# EAGLE design drive_board (EAGLE 6.1)
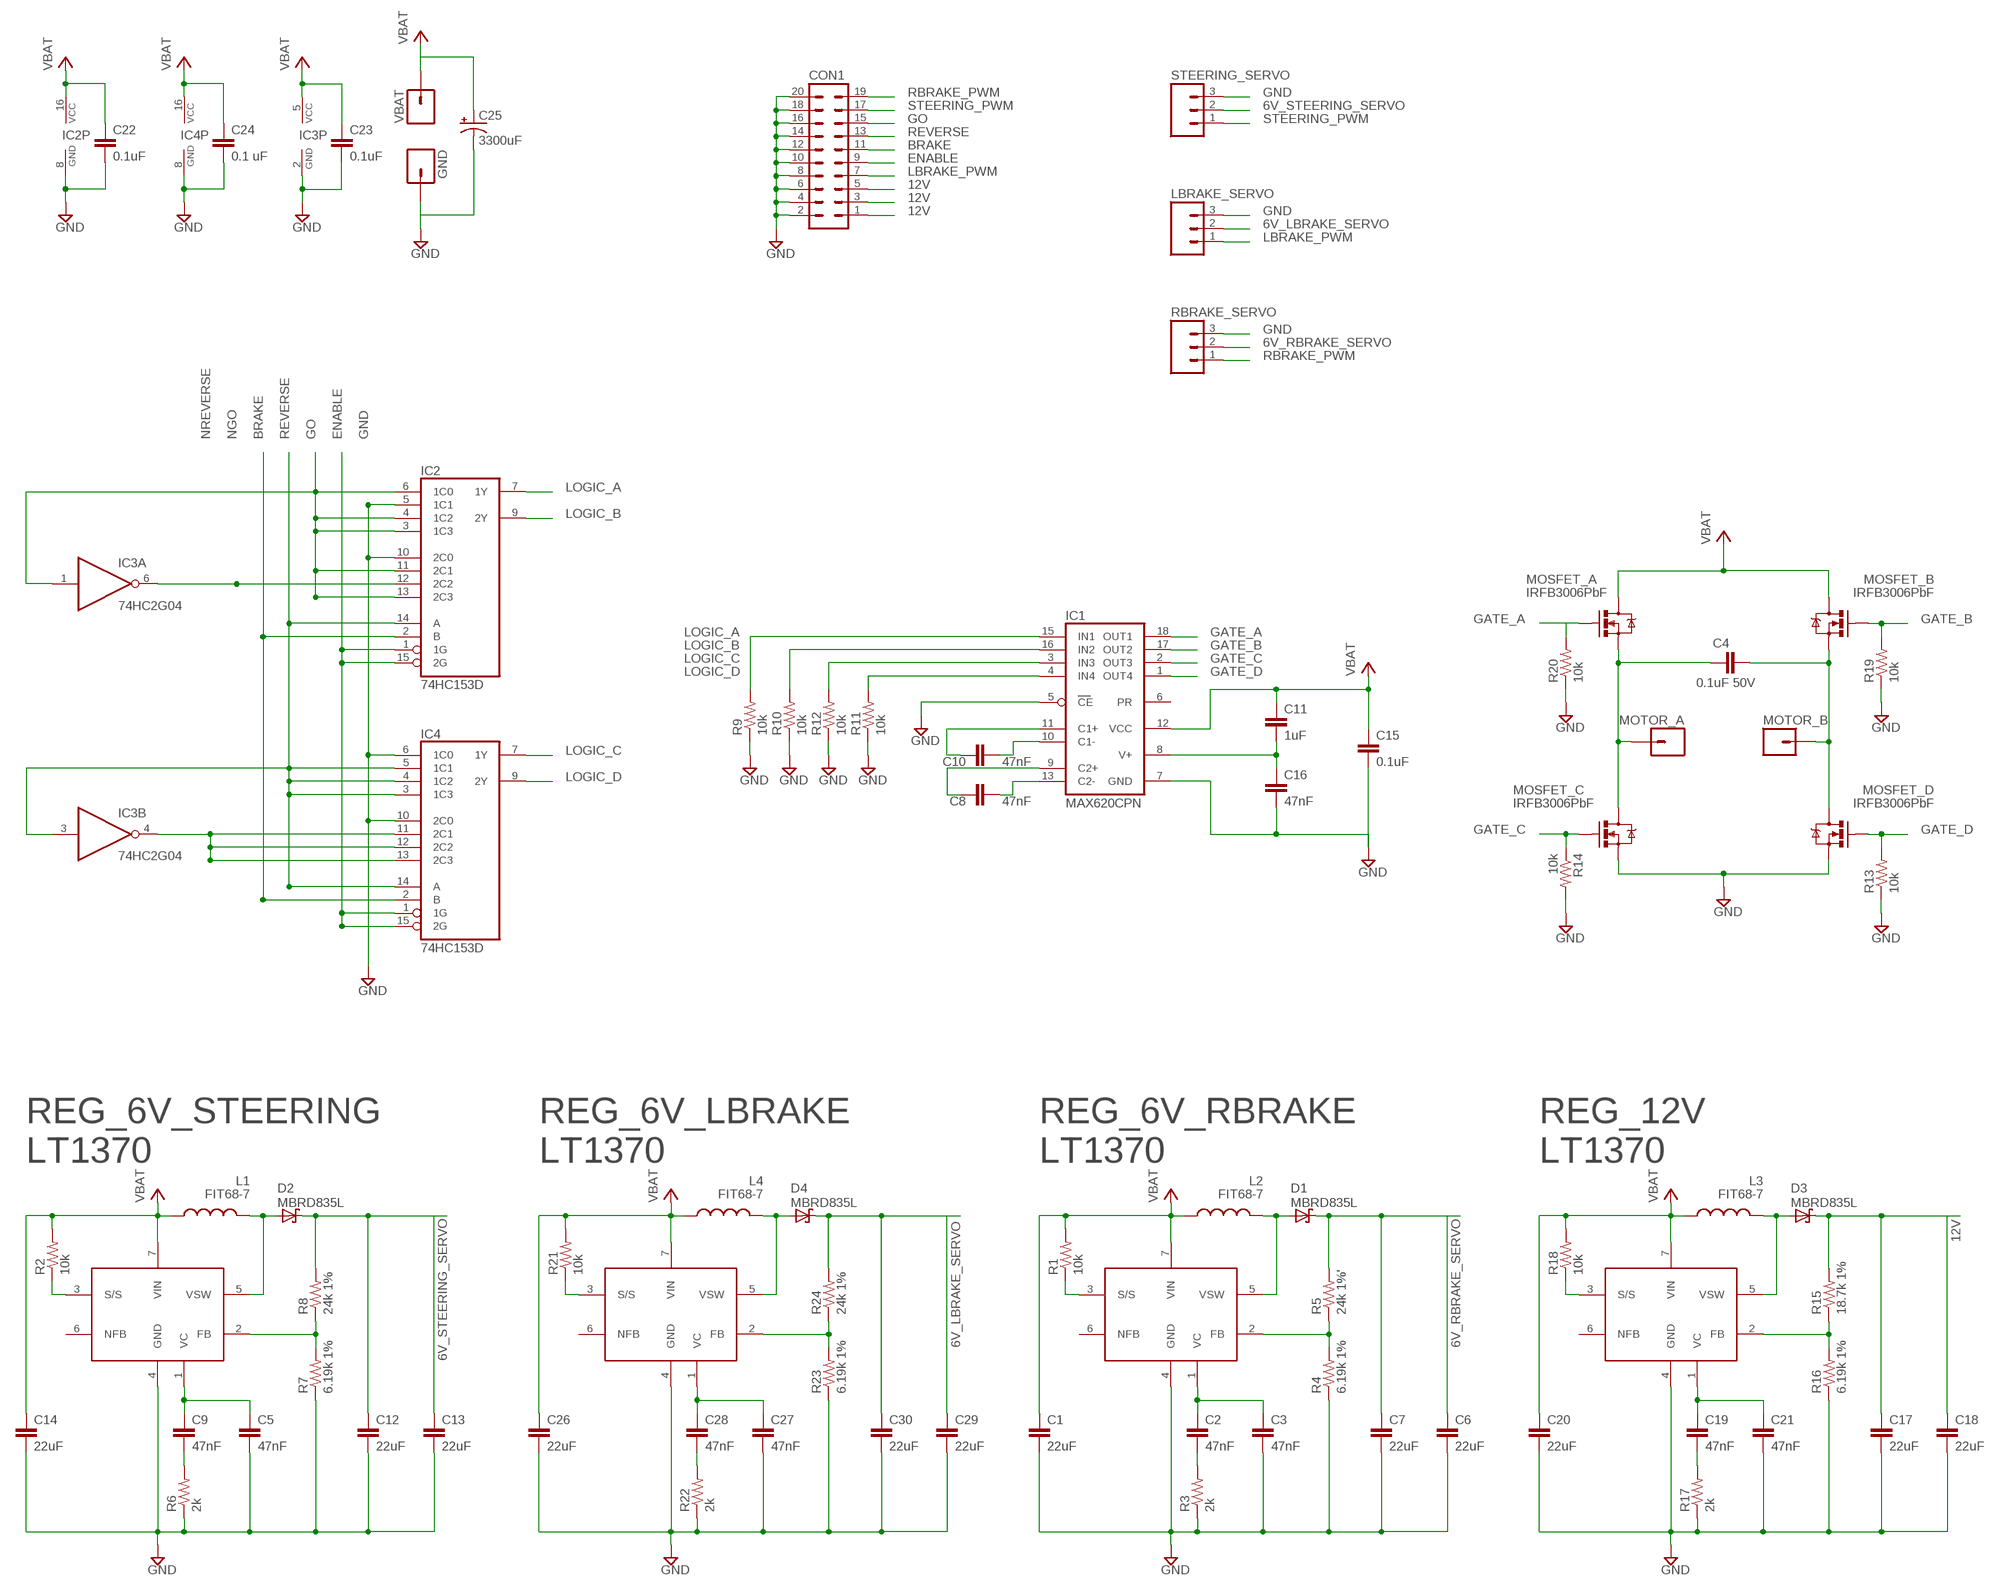
[diagram p0: schematic, sheet 1]

## Parts
C1  22uF  TPSD226M025R0200  [CAPACITOR_CASE_D]
C2  47nF  CAP0603-CAP  [0603-CAP]
C3  47nF  CAP0603-CAP  [0603-CAP]
C4  0.1uF 50V  CAP0603-CAP  [0603-CAP]
C5  47nF  CAP0603-CAP  [0603-CAP]
C6  22uF  TPSD226M025R0200  [CAPACITOR_CASE_D]
C7  22uF  TPSD226M025R0200  [CAPACITOR_CASE_D]
C8  47nF  CAP0603-CAP  [0603-CAP]
C9  47nF  CAP0603-CAP  [0603-CAP]
C10  47nF  CAP0603-CAP  [0603-CAP]
C11  1uF  CAP0603-CAP  [0603-CAP]
C12  22uF  TPSD226M025R0200  [CAPACITOR_CASE_D]
C13  22uF  TPSD226M025R0200  [CAPACITOR_CASE_D]
C14  22uF  TPSD226M025R0200  [CAPACITOR_CASE_D]
C15  0.1uF  CAP0603-CAP  [0603-CAP]
C16  47nF  CAP0603-CAP  [0603-CAP]
C17  22uF  TPSD226M025R0200  [CAPACITOR_CASE_D]
C18  22uF  TPSD226M025R0200  [CAPACITOR_CASE_D]
C19  47nF  CAP0603-CAP  [0603-CAP]
C20  22uF  TPSD226M025R0200  [CAPACITOR_CASE_D]
C21  47nF  CAP0603-CAP  [0603-CAP]
C22  0.1uF  CAP0603-CAP  [0603-CAP]
C23  0.1uF  CAP0603-CAP  [0603-CAP]
C24  0.1 uF  CAP0603-CAP  [0603-CAP]
C25  3300uF  CAP_POLPTH1  [CPOL-RADIAL-100UF-25V]
C26  22uF  TPSD226M025R0200  [CAPACITOR_CASE_D]
C27  47nF  CAP0603-CAP  [0603-CAP]
C28  47nF  CAP0603-CAP  [0603-CAP]
C29  22uF  TPSD226M025R0200  [CAPACITOR_CASE_D]
C30  22uF  TPSD226M025R0200  [CAPACITOR_CASE_D]
CON1  ML20  [ML20]
D1  MBRD835L  [DPACK_1]
D2  MBRD835L  [DPACK_1]
D3  MBRD835L  [DPACK_1]
D4  MBRD835L  [DPACK_1]
GND  GND  PAD_12GAPTH  [PAD_12GA]
IC1  MAX620CPN  [DIL18]
IC2  74HC153D  [SO16]
IC3  74HC2G04  [TSSOP6]
IC4  74HC153D  [SO16]
L1  FIT68-7  INDUCTOR  [TOROID_INDUCTOR]
L2  FIT68-7  INDUCTOR  [TOROID_INDUCTOR]
L3  FIT68-7  INDUCTOR  [TOROID_INDUCTOR]
L4  FIT68-7  INDUCTOR  [TOROID_INDUCTOR]
LBRAKE_SERVO  M03POLAR  [MOLEX-1X3]
MOSFET_A  IRFB3006PbF  MOSFET-NCHANNELPTH2  [TO220V]
MOSFET_B  IRFB3006PbF  MOSFET-NCHANNELPTH2  [TO220V]
MOSFET_C  IRFB3006PbF  MOSFET-NCHANNELPTH2  [TO220V]
MOSFET_D  IRFB3006PbF  MOSFET-NCHANNELPTH2  [TO220V]
MOTOR_A  MOTOR A  PAD_12GAPTH  [PAD_12GA]
MOTOR_B  MOTOR B  PAD_12GAPTH  [PAD_12GA]
R1  10k  RESISTOR0603-RES  [0603-RES]
R2  10k  RESISTOR0603-RES  [0603-RES]
R3  2k  RESISTOR0603-RES  [0603-RES]
R4  6.19k 1%  RESISTOR0603-RES  [0603-RES]
R5  24k 1%'  RESISTOR0603-RES  [0603-RES]
R6  2k  RESISTOR0603-RES  [0603-RES]
R7  6.19k 1%  RESISTOR0603-RES  [0603-RES]
R8  24k 1%  RESISTOR0603-RES  [0603-RES]
R9  10k  RESISTOR0603-RES  [0603-RES]
R10  10k  RESISTOR0603-RES  [0603-RES]
R11  10k  RESISTOR0603-RES  [0603-RES]
R12  10k  RESISTOR0603-RES  [0603-RES]
R13  10k  RESISTOR0603-RES  [0603-RES]
R14  10k  RESISTOR0603-RES  [0603-RES]
R15  18.7k 1%  RESISTOR0603-RES  [0603-RES]
R16  6.19k 1%  RESISTOR0603-RES  [0603-RES]
R17  2k  RESISTOR0603-RES  [0603-RES]
R18  10k  RESISTOR0603-RES  [0603-RES]
R19  10k  RESISTOR0603-RES  [0603-RES]
R20  10k  RESISTOR0603-RES  [0603-RES]
R21  10k  RESISTOR0603-RES  [0603-RES]
R22  2k  RESISTOR0603-RES  [0603-RES]
R23  6.19k 1%  RESISTOR0603-RES  [0603-RES]
R24  24k 1%  RESISTOR0603-RES  [0603-RES]
RBRAKE_SERVO  M03POLAR  [MOLEX-1X3]
REG_6V_LBRAKE  LT1370  [TO220-7]
REG_6V_RBRAKE  LT1370  [TO220-7]
REG_6V_STEERING  LT1370  [TO220-7]
REG_12V  LT1370  [TO220-7]
STEERING_SERVO  M03POLAR  [MOLEX-1X3]
VBAT  7.2V  PAD_12GAPTH  [PAD_12GA]

## Nets
6V_LBRAKE_SERVO: C29.P$1 C30.P$1 D4.C LBRAKE_SERVO.2 R24.2
6V_RBRAKE_SERVO: C6.P$1 C7.P$1 D1.C R5.2 RBRAKE_SERVO.2
6V_STEERING_SERVO: C12.P$1 C13.P$1 D2.C R8.2 STEERING_SERVO.2
12V: C17.P$1 C18.P$1 CON1.1 CON1.3 CON1.5 D3.C R15.2
BRAKE: CON1.11 IC2.2(B) IC4.2(B)
ENABLE: CON1.9 IC2.1(1G) IC2.15(2G) IC4.1(1G) IC4.15(2G)
GATE_A: IC1.18(OUT1) MOSFET_A.1(G) R20.2
GATE_B: IC1.17(OUT2) MOSFET_B.1(G) R19.2
GATE_C: IC1.2(OUT3) MOSFET_C.1(G) R14.1
GATE_D: IC1.1(OUT4) MOSFET_D.1(G) R13.2
GND: C1.P$2 C3.2 C5.2 C6.P$2 C7.P$2 C12.P$2 C13.P$2 C14.P$2 C15.2 C16.2 C17.P$2 C18.P$2 C20.P$2 C21.2 C22.2 C23.2 C24.2 C25.2(-) C26.P$2 C27.2 C29.P$2 C30.P$2 CON1.2 CON1.4 CON1.6 CON1.8 CON1.10 CON1.12 CON1.14 CON1.16 CON1.18 CON1.20 GND.1 IC1.5(CE) IC1.7(GND) IC2.5(1C1) IC2.8(GND) IC2.10(2C0) IC3.2(P:GND) IC4.6(1C0) IC4.8(GND) IC4.10(2C0) LBRAKE_SERVO.3 MOSFET_C.3(S) MOSFET_D.3(S) R3.1 R4.1 R6.1 R7.1 R9.1 R10.1 R11.1 R12.1 R13.1 R14.2 R16.1 R17.1 R19.1 R20.1 R22.1 R23.1 RBRAKE_SERVO.3 REG_6V_LBRAKE.4(GND) REG_6V_RBRAKE.4(GND) REG_6V_STEERING.4(GND) REG_12V.4(GND) STEERING_SERVO.3
GO: CON1.15 IC2.3(1C3) IC2.4(1C2) IC2.6(1C0) IC2.11(2C1) IC2.13(2C3) IC3.1(A:I)
LBRAKE_PWM: CON1.7 LBRAKE_SERVO.1
LOGIC_A: IC1.15(IN1) IC2.7(1Y) R9.2
LOGIC_B: IC1.16(IN2) IC2.9(2Y) R10.2
LOGIC_C: IC1.3(IN3) IC4.7(1Y) R12.2
LOGIC_D: IC1.4(IN4) IC4.9(2Y) R11.2
MOTOR_A: C4.1 MOSFET_A.3(S) MOSFET_C.2(D) MOTOR_A.1
MOTOR_B: C4.2 MOSFET_B.3(S) MOSFET_D.2(D) MOTOR_B.1
N$1: C10.1 IC1.11(C1+)
N$2: C10.2 IC1.10(C1-)
N$3: C8.2 IC1.13(C2-)
N$4: C8.1 IC1.9(C2+)
N$5: D2.B(A) D2.E(A) L1.2 REG_6V_STEERING.5(VSW)
N$6: R7.2 R8.1 REG_6V_STEERING.2(FB)
N$7: D4.B(A) D4.E(A) L4.2 REG_6V_LBRAKE.5(VSW)
N$8: R23.2 R24.1 REG_6V_LBRAKE.2(FB)
N$9: C5.1 C9.1 REG_6V_STEERING.1(VC)
N$10: C27.1 C28.1 REG_6V_LBRAKE.1(VC)
N$11: C9.2 R6.2
N$12: R2.1 REG_6V_STEERING.3(S/S)
N$13: C28.2 R22.2
N$14: R21.1 REG_6V_LBRAKE.3(S/S)
N$15: D1.B(A) D1.E(A) L2.2 REG_6V_RBRAKE.5(VSW)
N$16: R4.2 R5.1 REG_6V_RBRAKE.2(FB)
N$17: C2.1 C3.1 REG_6V_RBRAKE.1(VC)
N$18: C2.2 R3.2
N$19: R1.1 REG_6V_RBRAKE.3(S/S)
N$20: D3.B(A) D3.E(A) L3.2 REG_12V.5(VSW)
N$21: R15.1 R16.2 REG_12V.2(FB)
N$22: C19.1 C21.1 REG_12V.1(VC)
N$23: C19.2 R17.2
N$24: R18.1 REG_12V.3(S/S)
NGO: IC2.12(2C2) IC3.6(A:O)
NREVERSE: IC3.4(B:O) IC4.11(2C1) IC4.12(2C2) IC4.13(2C3)
RBRAKE_PWM: CON1.19 RBRAKE_SERVO.1
REVERSE: CON1.13 IC2.14(A) IC3.3(B:I) IC4.3(1C3) IC4.4(1C2) IC4.5(1C1) IC4.14(A)
STEERING_PWM: CON1.17 STEERING_SERVO.1
V+: C11.2 C16.1 IC1.8(V+)
VBAT: C1.P$1 C11.1 C14.P$1 C15.1 C20.P$1 C22.1 C23.1 C24.1 C25.1(+) C26.P$1 IC1.12(VCC) IC2.16(VCC) IC3.5(P:VCC) IC4.16(VCC) L1.1 L2.1 L3.1 L4.1 MOSFET_A.2(D) MOSFET_B.2(D) R1.2 R2.2 R18.2 R21.2 REG_6V_LBRAKE.7(VIN) REG_6V_RBRAKE.7(VIN) REG_6V_STEERING.7(VIN) REG_12V.7(VIN) VBAT.1
Unconnected: IC1.6(PR) REG_6V_LBRAKE.6(NFB) REG_6V_RBRAKE.6(NFB) REG_6V_STEERING.6(NFB) REG_12V.6(NFB)

## Library data of the parts
C1 C6 C7 C12-C14 C17 C18 C20 C26 C29 C30 = group10:TPSD226M025R0200
C2-C5 C8-C11 C15 C16 C19 C21 C27 C28 = SparkFun:CAP: Capacitor Standard 0603 ceramic capacitor, and 0.1" leaded capacitor.
C22-C24 = SparkFun-Passives:CAP: Capacitor Standard 0603 ceramic capacitor, and 0.1" leaded capacitor.
C25 = SparkFun-Passives:CAP_POL: Capacitor Polarized These are standard SMD and PTH capacitors. Normally 10uF, 47uF, and 100uF in electrolytic and tantalum varieties. Always verify the external diameter of the through hole cap, it varies with capacity, voltage, and manufacturer. The EIA devices should be standard.
CON1 = con-harting-ml:ML20: HARTING; OC_FARNELL: unknown; OC_NEWARK: unknown
D1-D4 = group10:MBRD835L
GND MOTOR_A MOTOR_B VBAT = group10:PAD_12GA: Header 1 Standard 1-pin 0.1" header. Use with straight break away headers (SKU : PRT-00116), right angle break away headers (PRT-00553), swiss pins (PRT-00743), machine pins (PRT-00117), and female headers (PRT-00115).
IC1 = maxim:MAX620CPN: MOSFET DRIVER; MPN: MAX620CPN+; OC_FARNELL: unknown; OC_NEWARK: 27M4142
IC2 IC4 = 74xx-eu:74*153: Dual 4-line to 1-line data SELECTOR/MULTIPLEXER
IC3 = group10:74HC2G04
L1-L4 = group10:INDUCTOR: Inductors Basic Inductor/Choke - 0603 and 1206. Footprints are not proven and vary greatly between part numbers.
LBRAKE_SERVO RBRAKE_SERVO STEERING_SERVO = SparkFun-Connectors:M03: Header 3 Standard 3-pin 0.1" header. Use with straight break away headers (SKU : PRT-00116), right angle break away headers (PRT-00553), swiss pins (PRT-00743), machine pins (PRT-00117), and female headers (PRT-00115). Molex polarized connector foot print use with SKU : PRT-08232 with associated crimp pins and housings.
MOSFET_A MOSFET_B MOSFET_C MOSFET_D = group10:MOSFET-NCHANNEL: Generic NMOS footprint
R1-R24 = SparkFun:RESISTOR: Resistor Basic schematic elements and footprints for 0603, 1206, and PTH resistors.
REG_6V_LBRAKE REG_6V_RBRAKE REG_6V_STEERING REG_12V = group10:LT1370

## Board
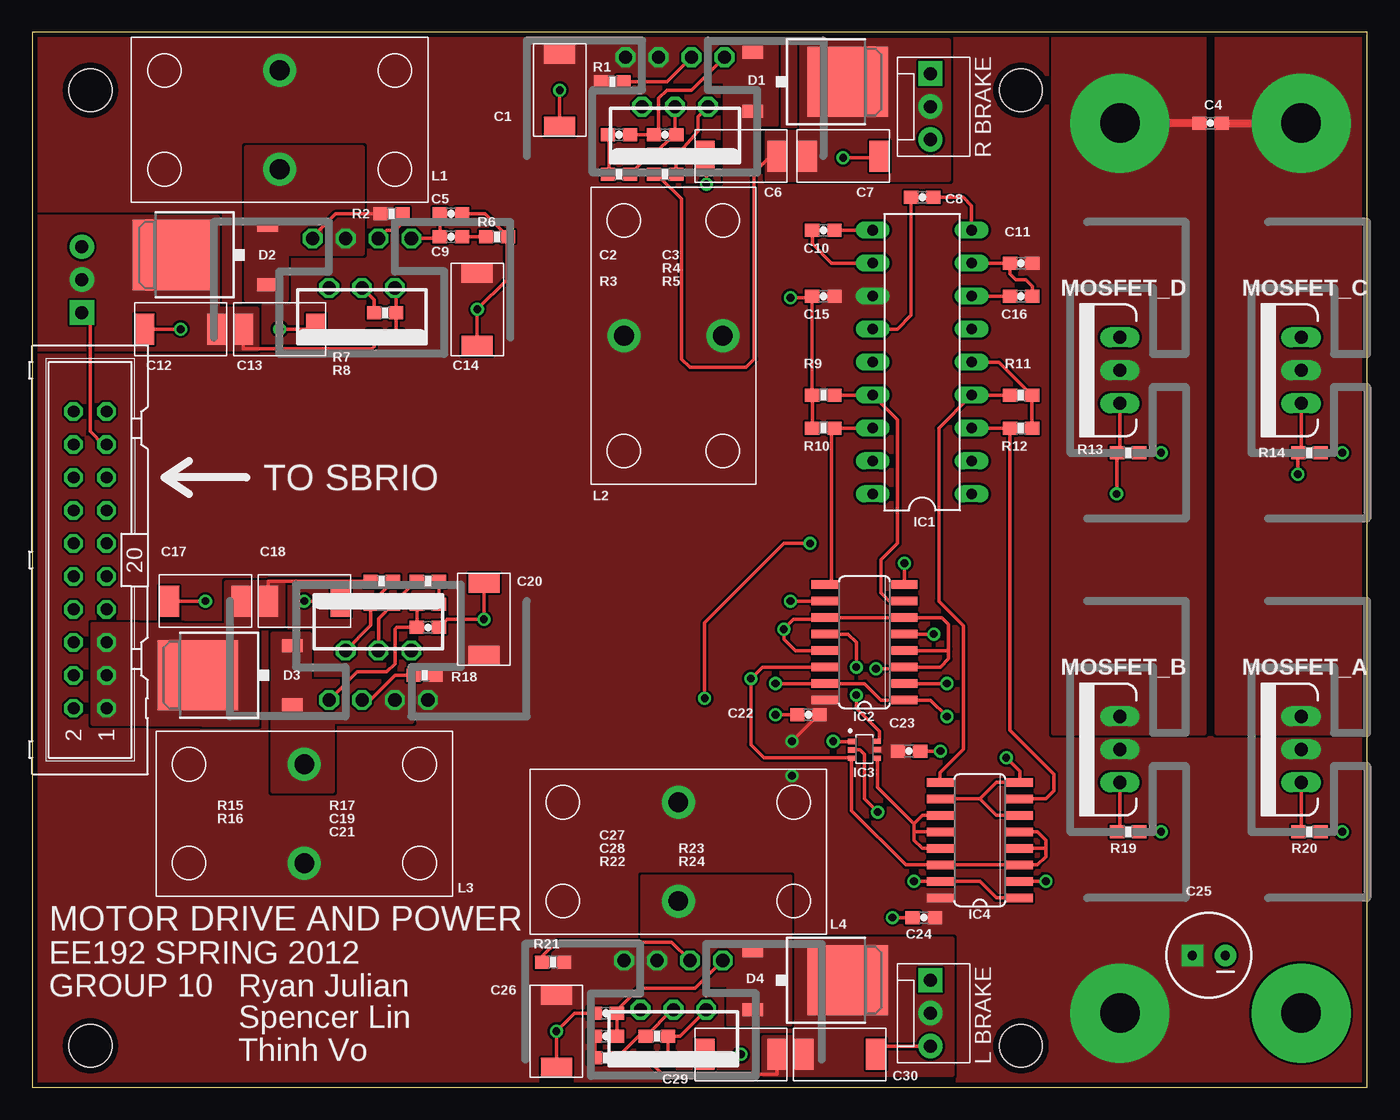
[diagram p1: board, top side]
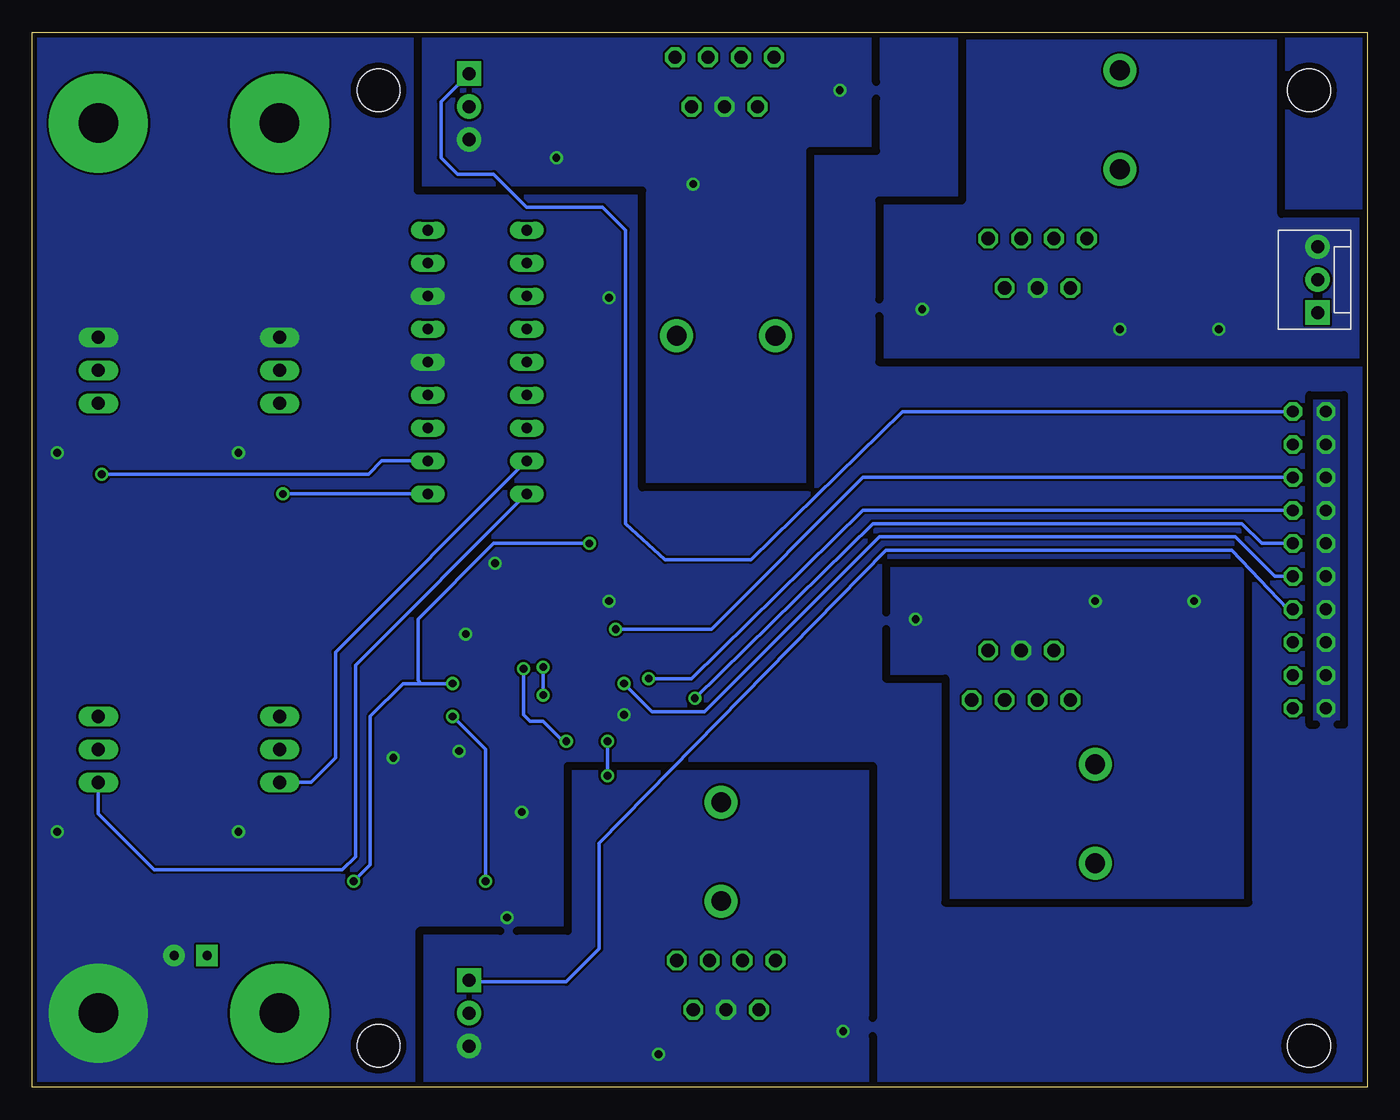
[diagram p2: board, bottom side, seen from below]

Size 102.87 x 81.28 mm. Coordinates in mm from the lower left corner, seen from the top.
Outline: 0,0 102.87,0 102.87,81.28 0,81.28 0,0
Copper layers (1*16): Top 0.035559375mm / dielectric 1.501140625mm / Bottom 0.035559375mm
Design rules: minimum track width 10mil, minimum drill 15mil, track to track 6mil, track to pad 6mil, pad to pad 6mil, via to via 6mil, smd to smd 6mil, copper to edge 15mil, drill to drill 8mil, minimum pad ring 10mil, minimum via ring 8mil, stop-mask expansion 4mil, vias tented up to drill 0mil, thermal gap 10mil
bRestrict: 36 lines

### Footprints (pad centres in the part's own frame; a part is rotated, then mirrored left to right if it is on the bottom)
CAPACITOR_CASE_D = smd 1.524 x 2.388: P$1 -2.794,0; P$2 2.794,0
0603-CAP = smd 1.1 x 1: 1 -0.85,0; 2 0.85,0
CPOL-RADIAL-100UF-25V = drill 0.7 pad 1.651 square: 1 1.27,0 | drill 0.7 pad 1.651: 2 -1.27,0
ML20 = drill 0.914 octagon: 1 -11.43,-1.27; 2 -11.43,1.27; 3 -8.89,-1.27; 4 -8.89,1.27; 5 -6.35,-1.27; 6 -6.35,1.27; 7 -3.81,-1.27; 8 -3.81,1.27; 9 -1.27,-1.27; 10 -1.27,1.27; 11 1.27,-1.27; 12 1.27,1.27; 13 3.81,-1.27; 14 3.81,1.27; 15 6.35,-1.27; 16 6.35,1.27; 17 8.89,-1.27; 18 8.89,1.27; 19 11.43,-1.27; 20 11.43,1.27
DPACK_1 = smd 1 x 1.6: B -2.28,-6.07; E 2.28,-6.07 | smd 5.4 x 6.2: C 0,1.23
PAD_12GA = drill 3.048 pad 7.62: 1 0,0
DIL18 = drill 0.813 long: 1 -10.16,-3.81; 2 -7.62,-3.81; 3 -5.08,-3.81; 4 -2.54,-3.81; 5 0,-3.81; 6 2.54,-3.81; 7 5.08,-3.81; 8 7.62,-3.81; 9 10.16,-3.81; 10 10.16,3.81; 11 7.62,3.81; 12 5.08,3.81; 13 2.54,3.81; 14 0,3.81; 15 -2.54,3.81; 16 -5.08,3.81; 17 -7.62,3.81; 18 -10.16,3.81
SO16 = smd 0.66 x 2.032: 1 -4.445,-3.073; 2 -3.175,-3.073; 3 -1.905,-3.073; 4 -0.635,-3.073; 5 0.635,-3.073; 6 1.905,-3.073; 7 3.175,-3.073; 8 4.445,-3.073; 9 4.445,3.073; 10 3.175,3.073; 11 1.905,3.073; 12 0.635,3.073; 13 -0.635,3.073; 14 -1.905,3.073; 15 -3.175,3.073; 16 -4.445,3.073
TSSOP6 = smd 0.55 x 0.4: 1 -0.99,0.61; 2 -0.99,-0.04; 3 -0.99,-0.69; 4 0.99,-0.69; 5 0.99,-0.015; 6 0.99,0.62
TOROID_INDUCTOR = drill 1.524 pad 2.54: 1 0,3.81; 2 0,-3.81
MOLEX-1X3 = drill 1.016 pad 1.88 square: 1 0,0 | drill 1.016 pad 1.88: 2 2.54,0; 3 5.08,0
TO220V = drill 1.016 long: 1 -2.54,0; 2 0,0; 3 2.54,0
0603-RES = smd 1.1 x 1: 1 -0.85,0; 2 0.85,0
TO220-7 = drill 1.016 octagon: 1 -3.81,3.81; 2 0,2.54; 3 -3.81,1.27; 4 0,0; 5 -3.81,-1.27; 6 0,-2.54; 7 -3.81,-3.81
STAND-OFF = hole 3.302: 0,0

### Placement (x,y rotation side)
C1  40.64,76.83 270 top
C2  45.21,73.41 180 top
C3  48.77,73.41 0 top
C4  90.81,74.3 180 top
C5  32.26,67.31 0 top
C6  54.61,71.75 180 top
C7  62.48,71.75 0 top
C8  68.58,68.58 180 top
C9  32.26,65.53 0 top
C10  60.96,66.04 0 top
C11  76.2,63.5 180 top
C12  11.43,58.42 180 top
C13  19.05,58.42 0 top
C14  34.29,59.94 270 top
C15  60.96,60.96 180 top
C16  76.2,60.96 180 top
C17  13.34,37.47 180 top
C18  20.95,37.47 0 top
C19  30.48,37.21 0 top
C20  34.8,36.07 90 top
C21  30.48,35.43 0 top
C22  59.82,28.7 180 top
C23  67.56,25.91 0 top
C24  68.71,13.08 180 top
C25  90.68,10.16 180 top
C26  40.39,4.32 270 top
C27  44.2,5.71 180 top
C28  44.2,3.94 180 top
C29  54.61,2.54 180 top
C30  62.23,2.54 0 top
CON1  4.45,40.64 90 top
D1  61.59,77.47 270 top
D2  12.06,64.14 90 top
D3  13.97,31.75 90 top
D4  61.59,8.26 270 top
GND  97.79,5.71 0 top
IC1  68.58,55.88 90 top
IC2  64.14,34.29 90 top
IC3  64.14,26.04 0 top
IC4  73.03,19.05 90 top
L1  19.05,74.55 0 top
L2  49.4,57.91 90 top
L3  20.95,21.08 180 top
L4  49.78,18.16 0 top
LBRAKE_SERVO  69.22,8.26 270 top
MOSFET_A  97.79,26.04 90 top
MOSFET_B  83.82,26.04 90 top
MOSFET_C  97.79,55.24 90 top
MOSFET_D  83.82,55.24 90 top
MOTOR_A  97.79,74.3 0 top
MOTOR_B  83.82,74.3 0 top
R1  44.7,77.47 180 top
R2  27.69,67.31 180 top
R3  45.21,70.36 180 top
R4  48.77,71.88 0 top
R5  48.77,70.36 180 top
R6  35.81,65.53 180 top
R7  27.18,59.69 0 top
R8  27.18,57.91 180 top
R9  60.96,53.34 0 top
R10  60.96,50.8 0 top
R11  76.2,53.34 180 top
R12  76.2,50.8 180 top
R13  84.45,48.9 180 top
R14  98.42,48.9 0 top
R15  26.92,38.99 180 top
R16  26.92,37.21 180 top
R17  30.48,38.99 0 top
R18  30.23,31.75 0 top
R19  84.45,19.68 180 top
R20  98.42,19.68 180 top
R21  40.13,9.65 0 top
R22  44.2,2.29 180 top
R23  48.13,3.94 0 top
R24  48.13,2.29 180 top
RBRAKE_SERVO  69.22,78.11 270 top
REG_6V_LBRAKE  49.4,5.97 270 top
REG_6V_RBRAKE  49.53,75.56 270 top
REG_6V_STEERING  25.4,61.59 270 top
REG_12V  26.67,33.66 90 top
STEERING_SERVO  3.81,59.69 90 bottom
U$1  [STAND-OFF]  4.47,76.83 0 top
U$2  [STAND-OFF]  76.2,76.83 0 top
U$3  [STAND-OFF]  4.47,3.2 0 top
U$4  [STAND-OFF]  76.2,3.2 0 top
VBAT  83.82,5.71 0 top

### Tracks (layer width: path | path; a pad name or v marks a point on that pad's centre or on a via)
6V_LBRAKE_SERVO
  Top 0.254: R24.2 48.55,1.02 57.4,1.02 C29.P$1
  pour Top (isolate 0.178, no thermals): 56.39,3.81 58.93,3.81 58.93,11.43 70.87,11.43 70.87,1.02 56.39,1.02
6V_RBRAKE_SERVO
  Top 0.254: C6.P$1 56.9,71.75 55.63,70.48 55.63,56.11 54.99,55.47 50.67,55.47 50.04,56.11 50.04,68.45 48.43,70.06 R5.2
  pour Top (isolate 0.178, no thermals): 59.31,80.64 59.31,73.53 56.64,73.53 56.64,69.98 70.61,69.98 70.61,80.64
6V_STEERING_SERVO
  Top 0.254: R8.2 26.33,57.06 26.16,56.9 16.26,56.9 C13.P$1
  pour Top (isolate 0.178, no thermals): 17.27,58.67 17.27,59.94 14.22,59.94 14.22,67.06 0,67.06 0,56.9 17.27,56.9
12V
  Top 0.254: 26.16,38.99 R15.2 18.16,38.99 C18.P$1
  pour Top (isolate 0.178, no thermals): 17.27,27.94 4.7,28.07 4.7,35.69 14.99,35.56 14.99,38.86 19.3,38.86 19.3,35.56 17.27,35.56
BRAKE  (via drill 0.6)
  Top 0.254: IC2.2 v70.48,31.11 | IC4.2 v78.11,15.88 | v51.82,29.97 51.82,35.81 57.91,41.91 v59.94,41.91
  Bottom 0.254: v70.48,31.11 72.9,31.11 | 72.9,31.11 74.3,31.11 76.83,28.57 76.83,17.14 v78.11,15.88 | CON1.11 8.13,41.91 9.65,43.43 38.1,43.43 v51.82,29.97 | v59.94,41.91 67.31,41.91 73.15,36.07 73.15,31.37 72.9,31.11
ENABLE  (via drill 0.6)
  Top 0.254: IC4.1 74.3,14.61 73.03,15.88 IC4.15 v67.94,15.88 | v70.48,28.57 69.22,29.84 IC2.1 65.41,29.84 64.14,31.11 IC2.15 v57.28,31.11
  Bottom 0.254: v70.48,28.57 67.94,26.04 v67.94,15.88 | CON1.9 7.11,39.37 10.16,42.42 37.59,42.42 51.05,28.96 55.12,28.96 v57.28,31.11
GATE_A
  Top 0.254: MOSFET_A.1 97.79,19.68 R20.2
  Bottom 0.254: IC1.18 77.98,32.51 77.98,17.78 78.99,16.76 93.47,16.76 97.79,21.08 MOSFET_A.1
GATE_B
  Top 0.254: MOSFET_B.1 83.82,19.68 R19.2
  Bottom 0.254: IC1.17 79.5,33.53 79.5,25.4 81.41,23.5 MOSFET_B.1
GATE_C  (via drill 0.6)
  Top 0.254: MOSFET_C.1 97.79,48.9 R14.1 97.54,48.86 v97.54,47.24
  Bottom 0.254: IC1.2 75.95,48.26 76.96,47.24 v97.54,47.24
GATE_D  (via drill 0.6)
  Top 0.254: MOSFET_D.1 83.82,48.9 R13.2 83.57,48.9 | 83.19,48.9 83.57,48.9 | 83.57,48.9 v83.57,45.72
  Bottom 0.254: IC1.1 v83.57,45.72
GND  (via drill 0.6)
  Top 0.254: R13.1 v87,48.9 | R14.2 v100.97,48.9 | R19.1 v87,19.68 | R20.1 v100.97,19.68 | IC2.10 v58.42,37.47 | IC2.8 v67.21,40.39 | IC2.5 v69.47,34.92 | C24.2 v66.29,13.08 | C23.2 v69.98,25.91 | v75.06,25.4 76.1,24.36 IC4.8 74.3,23.5 73.03,22.23 | 73.03,22.23 IC4.10 | IC4.6 74.3,20.95 73.03,22.23 | C22.2 v57.28,28.7 | IC3.2 63.79,26 64.14,25.65 64.14,22.23 v65.15,21.21 | R10.1 60.11,53.3 60.07,53.34 | 60.07,53.34 60.07,60.83 | 60.07,60.83 v58.42,60.83 | 60.07,60.83 60.07,60.92 C15.2 | IC1.5 74.51,55.88 R11.1 R12.1 | IC1.7 C16.2 | C26.P$2 v40.39,4.32 41.78,5.71 C27.2 | C17.P$2 v13.34,37.47 | C14.P$2 v34.29,59.94 36.58,62.23 36.58,65.53 R6.1 34.89,67.31 C5.2 | C1.P$2 v40.64,76.83 | C30.P$2 65.66,3.17 LBRAKE_SERVO.3 | R22.1 46.7,3.94 R23.1 49.31,5.97 REG_6V_LBRAKE.4 | C29.P$2 v54.61,2.54 | C20.P$2 v34.8,36.07 31.96,36.07 C21.2 | C18.P$2 v20.95,37.47 | REG_12V.4 26.67,36.11 R16.1 29.55,38.99 R17.1 | REG_6V_STEERING.4 26.33,60.67 R7.1 | C13.P$2 v19.05,58.42 | C7.P$2 65.15,71.63 v62.48,71.63 | R3.1 47.59,71.88 R4.1 49.44,73.41 C3.2 | 49.66,73.41 C3.2 | C3.2 49.53,73.49 REG_6V_RBRAKE.4 | C6.P$2 51.94,71.63 v51.94,69.6 | C12.P$2 v11.43,58.42 | R9.1 60.07,53.34
  pour Bottom (isolate 0.178, rank 6, no thermals): 0,81.28 102.87,81.28 102.87,0 0,0
GO  (via drill 0.6)
  Top 0.254: v65.02,32.26 67.08,32.26 IC2.3 69.98,32.38 70.61,33.02 70.61,33.78 | IC3.1 61.75,26.64 v61.72,26.67 | 70.61,33.78 70.61,35.69 70.1,36.2 IC2.6 IC2.11 60.96,36.09 60.96,36.07 58.67,36.07 v57.91,35.31 57.91,34.54 58.8,33.66 IC2.13 | IC2.4 70.48,33.66 70.61,33.78
  Bottom 0.254: v61.72,26.67 61.98,26.67 63.5,28.19 64.52,28.19 65.02,28.7 v65.02,32.26 | CON1.15 38.86,46.99 50.55,35.31 v57.91,35.31 58.04,35.31
LBRAKE_PWM
  Bottom 0.254: CON1.7 6.1,36.83 10.41,41.4 37.08,41.4 59.18,18.8 59.18,10.67 61.72,8.13 69.09,8.13 LBRAKE_SERVO.1
LOGIC_A
  Top 0.254: R9.2 IC1.15 66.67,51.44 66.67,41.91 65.41,40.64 65.41,38.1 66.04,37.47 IC2.7
LOGIC_B
  Top 0.254: IC1.16 R10.2 61.59,50.8 61.59,38.73 IC2.9
LOGIC_C
  Top 0.254: IC1.3 R12.2 75.35,27.52 78.74,24.13 78.74,22.86 78.11,22.23 IC4.7
LOGIC_D
  Top 0.254: IC4.9 69.95,24.23 71.75,26.04 71.75,35.56 69.85,37.47 69.85,50.8 IC1.4 R11.2 75.56,53.34
MOTOR_A
  Top 0.61: C4.1 MOTOR_A.1
  pour Top (isolate 0.178, no thermals): 102.87,81.28 91.31,81.28 91.31,27.3 102.87,27.3
MOTOR_B
  Top 0.61: C4.2 83.95,74.3 83.82,74.42
  pour Top (isolate 0.178, no thermals): 90.3,81.28 78.74,81.28 78.74,27.3 90.3,27.3
N$1
  Top 0.254: C10.1 60.11,64.98 61.59,63.5 IC1.11
N$2
  Top 0.254: C10.2 IC1.10
N$3
  Top 0.254: C8.2 67.73,59.48 66.67,58.42 IC1.13
N$4
  Top 0.254: C8.1 71.75,68.58 72.39,67.94 IC1.9
N$5
  pour Top (isolate 0.178, no thermals): 19.56,60.71 16.51,60.71 16.51,72.39 25.4,72.39 25.4,64.26 19.56,64.26
N$6
  Top 0.254: R8.1 28.03,59.44 R7.2 28.03,61.51 REG_6V_STEERING.2
N$7
  pour Top (isolate 0.178, no thermals): 58.42,16.26 46.99,16.26 46.99,7.87 53.59,7.87 53.59,4.83 58.42,4.83
N$8
  Top 0.254: REG_6V_LBRAKE.2 49.91,3.94 R23.2 49.02,3.9 49.02,3.81 48.98,3.77 R24.1
N$9
  Top 0.254: 29.25,65.37 REG_6V_STEERING.1 31.15,65.41 C9.1 | C5.1 C9.1 | 31.24,65.28 31.28,65.32 C9.1
N$10
  Top 0.254: REG_6V_LBRAKE.1 51.05,7.62 46.74,7.62 45.05,5.93 C27.1 C28.1
N$11
  Top 0.254: C9.2 R6.2
N$12
  Top 0.254: R2.1 28.54,66.64 27.94,66.04 27.3,66.04 REG_6V_STEERING.3
N$13
  Top 0.254: R22.2 C28.2
N$14
  Top 0.254: REG_6V_LBRAKE.3 49.28,11.18 40.39,11.18 39.37,10.16 39.37,9.65 R21.1
N$15
  pour Top (isolate 0.178, no thermals): 55.88,55.88 50.29,55.88 50.29,69.34 53.34,69.34 53.34,77.47 47.24,77.47 47.24,81.28 57.4,81.28 57.4,74.17 55.88,74.17
N$16
  Top 0.254: REG_6V_RBRAKE.2 51.31,74.8 51.31,73.66 50.16,72.39 49.74,71.97 49.62,71.97 R4.2 R5.1
N$17
  Top 0.254: REG_6V_RBRAKE.1 50.8,76.83 48.9,76.83 48.26,76.2 48.26,73.75 C3.1 C2.1
N$18
  Top 0.254: C2.2 44.45,73.32 44.45,70.36 R3.2
N$19
  Top 0.254: REG_6V_RBRAKE.3 48.9,77.47 R1.1
N$20
  pour Top (isolate 0.178, no thermals): 21.34,34.92 18.54,34.92 18.54,22.86 23.11,22.86 23.11,28.19 29.21,28.19 29.21,31.24 21.34,31.24
N$21
  Top 0.254: R15.1 R16.2 26.07,35.6 REG_12V.2
N$22
  Top 0.254: C19.1 C21.1 | C21.1 29.25,35.05 | REG_12V.1 25.02,32 27.3,32 27.94,32.64 27.94,35.31 28.07,35.43 C21.1
N$23
  Top 0.254: R17.2 C19.2
N$24
  Top 0.254: REG_12V.3 26.04,29.84 27.94,31.75 R18.1
NGO  (via drill 0.6)
  Top 0.254: IC2.12 62.87,34.92 63.5,34.29 v63.5,32.38 | v63.5,30.23 63.5,29.21 65.28,27.43 65.28,26.81 IC3.6
  Bottom 0.254: v63.5,32.38 v63.5,30.23
NREVERSE
  Top 0.254: IC4.11 68.58,20.95 67.94,20.32 | 67.94,20.32 67.94,19.68 | 67.94,19.68 67.94,19.05 68.58,18.41 IC4.13 | IC4.12 67.94,19.68 | IC3.4 65.12,23.14 67.94,20.32
RBRAKE_PWM
  Bottom 0.254: CON1.19 35.81,52.07 47.5,40.64 54.1,40.64 57.15,43.43 57.15,66.04 58.93,67.82 64.77,67.82 67.31,70.36 70.1,70.36 71.37,71.63 71.37,75.95 RBRAKE_SERVO.1
REVERSE  (via drill 0.6)
  Top 0.254: IC4.5 77.47,19.68 78.11,19.05 78.11,18.41 | 78.11,18.41 78.11,17.78 77.47,17.14 IC4.3 IC4.14 67.31,17.14 63.15,21.31 IC3.3 63.09,25.4 56.39,25.4 55.37,26.42 v55.37,31.5 56.26,32.38 IC2.14 | IC4.4 78.11,18.41
  Bottom 0.254: CON1.13 38.86,44.45 52.07,31.5 v55.37,31.5
STEERING_PWM
  Top 0.254: STEERING_SERVO.1 4.45,59.05 4.45,50.55 5.46,49.53 CON1.17
V+
  Top 0.254: IC1.8 C11.2 75.35,62.7 75.82,62.23 76.58,62.23 77.09,61.72 77.09,61 C16.1
VBAT  (via drill 0.6)
  Top 0.254: C22.1 60.58,28.7 v58.55,26.67 | R2.2 23.37,67.31 21.59,65.53 REG_6V_STEERING.7
  Bottom 0.254: v58.55,26.67 v58.55,24
  pour Top (isolate 0.178, rank 2, no thermals): 0,81.28 102.87,81.28 102.87,0 0,0

### Text on the board
tNames: R BRAKE | TO SBRIO | MOTOR DRIVE AND POWER | EE192 SPRING 2012 | GROUP 10 | Ryan Julian | Spencer Lin | Thinh Vo | L BRAKE